# EAGLE design Sat_Cape.v8 (EAGLE 7.5.0)
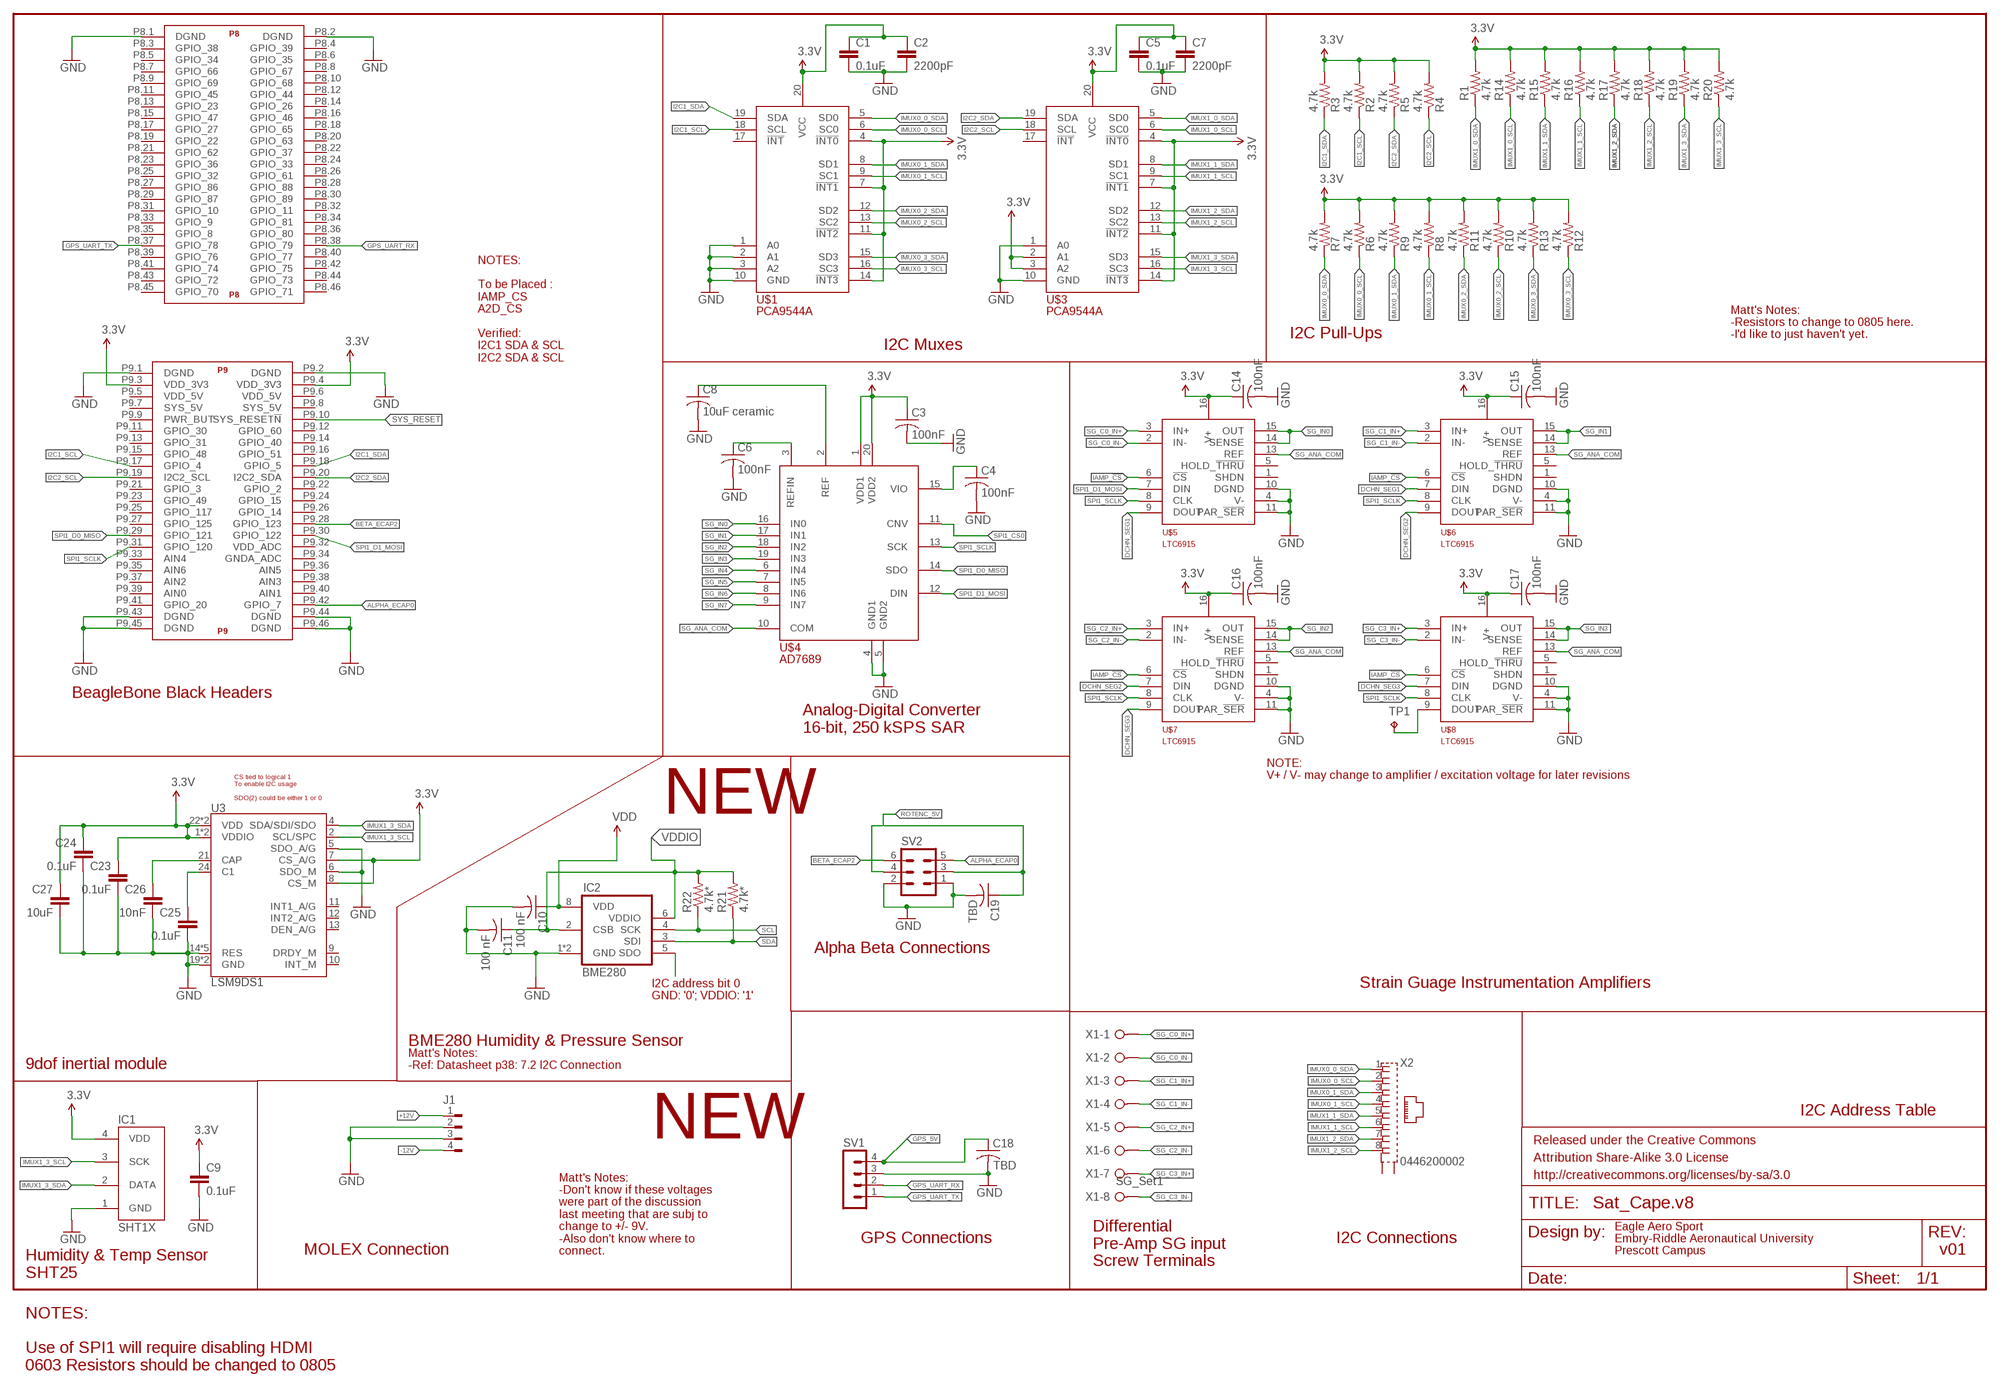
[diagram p0: schematic, sheet 1]

## Parts
C1  0.1uF  0.1UF-25V(+80/-20%)(0603)  [0603-CAP]
C2  2200pF  0.1UF-25V(+80/-20%)(0603)  [0603-CAP]
C3  100nF  C-USC0805  [C0805]
C4  100nF  C-USC0805  [C0805]
C5  0.1uF  0.1UF-25V(+80/-20%)(0603)  [0603-CAP]
C6  100nF  C-USC0805  [C0805]
C7  2200pF  0.1UF-25V(+80/-20%)(0603)  [0603-CAP]
C8  10uF ceramic  C-USC0805  [C0805]
C9  0.1uF  0.1UF-25V(+80/-20%)(0603)  [0603-CAP]
C10  100 nF  C-USC0805  [C0805]
C11  100 nF  C-USC0805  [C0805]
C14  100nF  C-USC0805  [C0805]
C15  100nF  C-USC0805  [C0805]
C16  100nF  C-USC0805  [C0805]
C17  100nF  C-USC0805  [C0805]
C18  TBD  C-USC0805  [C0805]
C19  TBD  C-USC0805  [C0805]
C23  0.1uF  0.1UF-25V(+80/-20%)(0603)  [0603-CAP]
C24  0.1uF  0.1UF-25V(+80/-20%)(0603)  [0603-CAP]
C25  0.1uF  0.1UF-25V(+80/-20%)(0603)  [0603-CAP]
C26  10nF  10NF/10000PF-50V-10%(0603)  [0603-CAP]
C27  10uF  10UF-6.3V-20%(0603)  [0603-CAP]
FRAME1  FRAME-LEDGER  [CREATIVE_COMMONS]
IC1  SHT1X  [SHT1X]
IC2  BME280  [BME280]
J1  FLOPPY-4350211  [350211]
R1  4.7k  R-US_R0805  [R0805]
R2  4.7k  10KOHM1/10W1%(0603)0603  [0603-RES]
R3  4.7k  10KOHM1/10W1%(0603)0603  [0603-RES]
R4  4.7k  10KOHM1/10W1%(0603)0603  [0603-RES]
R5  4.7k  10KOHM1/10W1%(0603)0603  [0603-RES]
R6  4.7k  10KOHM1/10W1%(0603)0603  [0603-RES]
R7  4.7k  10KOHM1/10W1%(0603)0603  [0603-RES]
R8  4.7k  10KOHM1/10W1%(0603)0603  [0603-RES]
R9  4.7k  10KOHM1/10W1%(0603)0603  [0603-RES]
R10  4.7k  10KOHM1/10W1%(0603)0603  [0603-RES]
R11  4.7k  10KOHM1/10W1%(0603)0603  [0603-RES]
R12  4.7k  10KOHM1/10W1%(0603)0603  [0603-RES]
R13  4.7k  10KOHM1/10W1%(0603)0603  [0603-RES]
R14  4.7k  R-US_R0805  [R0805]
R15  4.7k  R-US_R0805  [R0805]
R16  4.7k  R-US_R0805  [R0805]
R17  4.7k  R-US_R0805  [R0805]
R18  4.7k  R-US_R0805  [R0805]
R19  4.7k  R-US_R0805  [R0805]
R20  4.7k  R-US_R0805  [R0805]
R21  4.7k*  R-US_R0805  [R0805]
R22  4.7k*  R-US_R0805  [R0805]
SV1  MA04-1  [MA04-1]
SV2  MA03-2  [MA03-2]
TP1  TPTP08R  [TP08R]
U3  LSM9DS1  [LGA24-8X4]
U$1  PCA9544A  [TSSOP20]
U$2  BEAGLE_BONE_BLACK_CAPE  [BEAGLE_BONE_BLACK_CAPE]
U$3  PCA9544A  [TSSOP20]
U$4  AD7689  [QFN20]
U$5  LTC6915  [SSOP16]
U$6  LTC6915  [SSOP16]
U$7  LTC6915  [SSOP16]
U$8  LTC6915  [SSOP16]
X1  SG_Set1  W237-08P  [W237-8P]
X2  0446200002  [0446200002]

## Nets
3.3V: C1.1 C2.1 C3.1 C5.1 C7.1 C9.1 C14.1 C15.1 C16.1 C17.1 C23.1 C24.1 C27.1 IC1.4(VDD) R1.2 R2.2 R3.2 R4.2 R5.2 R6.2 R7.2 R8.2 R9.2 R10.2 R11.2 R12.2 R13.2 R14.2 R15.2 R16.2 R17.2 R18.2 R19.2 R20.2 U3.1(VDDIO) U3.3(VDDIO) U3.7(CS_A/G) U3.8(CS_M) U3.22(VDD) U3.23(VDD) U$1.4(!INT0!) U$1.7(!INT1!) U$1.11(!INT2!) U$1.14(!INT3!) U$1.20(VCC) U$2.P9.3(P9:VDD_3V3) U$2.P9.4(P9:VDD_3V3) U$3.2(A1) U$3.3(A2) U$3.4(!INT0!) U$3.7(!INT1!) U$3.11(!INT2!) U$3.14(!INT3!) U$3.20(VCC) U$4.1(VDD1) U$4.20(VDD2) U$5.16(V+) U$6.16(V+) U$7.16(V+) U$8.16(V+)
+12V: J1.1
-12V: J1.4
ALPHA_ECAP0: SV2.5 U$2.P9.42(P9:GPIO_7)
BETA_ECAP2: SV2.6 U$2.P9.28(P9:GPIO_123)
C1: C25.1 U3.24(C1)
CAP: C26.1 U3.21(CAP)
DCHN_SEG1: U$5.9(DOUT) U$6.7(DIN)
DCHN_SEG2: U$6.9(DOUT) U$7.7(DIN)
DCHN_SEG3: U$7.9(DOUT) U$8.7(DIN)
GND: C1.2 C2.2 C3.2 C4.2 C5.2 C6.2 C7.2 C8.2 C9.2 C10.2 C11.2 C14.2 C15.2 C16.2 C17.2 C18.2 C19.2 C23.2 C24.2 C25.2 C26.2 C27.2 IC1.1(GND) IC2.1(GND) IC2.7(GND) J1.2 J1.3 SV1.3 SV2.1 SV2.2 U3.5(SDO_A/G) U3.6(SDO_M) U3.14(RES) U3.15(RES) U3.16(RES) U3.17(RES) U3.18(RES) U3.19(GND) U3.20(GND) U$1.1(A0) U$1.2(A1) U$1.3(A2) U$1.10(GND) U$2.P8.1(P8:DGND) U$2.P8.2(P8:DGND) U$2.P9.1(P9:DGND) U$2.P9.2(P9:DGND) U$2.P9.43(P9:DGND) U$2.P9.44(P9:DGND) U$2.P9.45(P9:DGND) U$2.P9.46(P9:DGND) U$3.1(A0) U$3.10(GND) U$4.4(GND1) U$4.5(GND2) U$5.4(V-) U$5.10(DGND) U$5.11(PAR_!SER!) U$6.4(V-) U$6.10(DGND) U$6.11(PAR_!SER!) U$7.4(V-) U$7.10(DGND) U$7.11(PAR_!SER!) U$8.4(V-) U$8.10(DGND) U$8.11(PAR_!SER!)
GPS_5V: C18.1 SV1.4
GPS_UART_RX: SV1.2 U$2.P8.38(P8:GPIO_79)
GPS_UART_TX: SV1.1 U$2.P8.37(P8:GPIO_78)
I2C1_SCL: R2.1 U$1.18(SCL) U$2.P9.17(P9:GPIO_4)
I2C1_SDA: R3.1 U$1.19(SDA) U$2.P9.18(P9:GPIO_5)
I2C2_SCL: R4.1 U$2.P9.19(P9:I2C2_SCL) U$3.18(SCL)
I2C2_SDA: R5.1 U$2.P9.20(P9:I2C2_SDA) U$3.19(SDA)
IAMP_!CS!: U$5.6(!CS!) U$6.6(!CS!) U$7.6(!CS!) U$8.6(!CS!)
IMUX0_0_SCL: R6.1 U$1.6(SC0) X2.2
IMUX0_0_SDA: R7.1 U$1.5(SD0) X2.1
IMUX0_1_SCL: R8.1 U$1.9(SC1) X2.4
IMUX0_1_SDA: R9.1 U$1.8(SD1) X2.3
IMUX0_2_SCL: R10.1 U$1.13(SC2)
IMUX0_2_SDA: R11.1 U$1.12(SD2)
IMUX0_3_SCL: R12.1 U$1.16(SC3)
IMUX0_3_SDA: R13.1 U$1.15(SD3)
IMUX1_0_SCL: R14.1 U$3.6(SC0)
IMUX1_0_SDA: R1.1 U$3.5(SD0)
IMUX1_1_SCL: R16.1 U$3.9(SC1) X2.6
IMUX1_1_SDA: R15.1 U$3.8(SD1) X2.5
IMUX1_2_SCL: R18.1 U$3.13(SC2) X2.8
IMUX1_2_SDA: R17.1 U$3.12(SD2) X2.7
IMUX1_3_SCL: IC1.3(SCK) R20.1 U3.2(SCL/SPC) U$3.16(SC3)
IMUX1_3_SDA: IC1.2(DATA) R19.1 U3.4(SDA/SDI/SDO) U$3.15(SD3)
N$5: C6.1 U$4.3(REFIN)
N$6: C8.1 U$4.2(REF)
N$12: C4.1 U$4.15(VIO)
N$19: TP1.TP U$8.9(DOUT)
N$20: IC2.5(SDO)
ROTENC_5V: C19.1 SV2.3 SV2.4
SCL: IC2.4(SCK) R22.1
SDA: IC2.3(SDI) R21.1
SG_ANA_COM: U$4.10(COM) U$5.13(REF) U$6.13(REF) U$7.13(REF) U$8.13(REF)
SG_C0_IN+: U$5.3(IN+) X1.1
SG_C0_IN-: U$5.2(IN-) X1.2
SG_C1_IN+: U$6.3(IN+) X1.3
SG_C1_IN-: U$6.2(IN-) X1.4
SG_C2_IN+: U$7.3(IN+) X1.5
SG_C2_IN-: U$7.2(IN-) X1.6
SG_C3_IN+: U$8.3(IN+) X1.7
SG_C3_IN-: U$8.2(IN-) X1.8
SG_IN0: U$4.16(IN0) U$5.14(SENSE) U$5.15(OUT)
SG_IN1: U$4.17(IN1) U$6.14(SENSE) U$6.15(OUT)
SG_IN2: U$4.18(IN2) U$7.14(SENSE) U$7.15(OUT)
SG_IN3: U$4.19(IN3) U$8.14(SENSE) U$8.15(OUT)
SG_IN4: U$4.6(IN4)
SG_IN5: U$4.7(IN5)
SG_IN6: U$4.8(IN6)
SG_IN7: U$4.9(IN7)
SPI1_CS0: U$4.11(CNV)
SPI1_D0_MISO: U$2.P9.29(P9:GPIO_121) U$4.14(SDO)
SPI1_D1_MOSI: U$2.P9.30(P9:GPIO_122) U$4.12(DIN) U$5.7(DIN)
SPI1_SCLK: U$2.P9.31(P9:GPIO_120) U$4.13(SCK) U$5.8(CLK) U$6.8(CLK) U$7.8(CLK) U$8.8(CLK)
SYS_RESET: U$2.P9.10(P9:SYS_RESET!N)
VDD: C10.1 IC2.8(VDD)
VDDIO: C11.1 IC2.2(CSB) IC2.6(VDDIO) R21.2 R22.2
Unconnected: U3.9(DRDY_M) U3.10(INT_M) U3.11(INT1_A/G) U3.12(INT2_A/G) U3.13(DEN_A/G) U$1.17(!INT!) U$2.P8.3(P8:GPIO_38) U$2.P8.4(P8:GPIO_39) U$2.P8.5(P8:GPIO_34) U$2.P8.6(P8:GPIO_35) U$2.P8.7(P8:GPIO_66) U$2.P8.8(P8:GPIO_67) U$2.P8.9(P8:GPIO_69) U$2.P8.10(P8:GPIO_68) U$2.P8.11(P8:GPIO_45) U$2.P8.12(P8:GPIO_44) U$2.P8.13(P8:GPIO_23) U$2.P8.14(P8:GPIO_26) U$2.P8.15(P8:GPIO_47) U$2.P8.16(P8:GPIO_46) U$2.P8.17(P8:GPIO_27) U$2.P8.18(P8:GPIO_65) U$2.P8.19(P8:GPIO_22) U$2.P8.20(P8:GPIO_63) U$2.P8.21(P8:GPIO_62) U$2.P8.22(P8:GPIO_37) U$2.P8.23(P8:GPIO_36) U$2.P8.24(P8:GPIO_33) U$2.P8.25(P8:GPIO_32) U$2.P8.26(P8:GPIO_61) U$2.P8.27(P8:GPIO_86) U$2.P8.28(P8:GPIO_88) U$2.P8.29(P8:GPIO_87) U$2.P8.30(P8:GPIO_89) U$2.P8.31(P8:GPIO_10) U$2.P8.32(P8:GPIO_11) U$2.P8.33(P8:GPIO_9) U$2.P8.34(P8:GPIO_81) U$2.P8.35(P8:GPIO_8) U$2.P8.36(P8:GPIO_80) U$2.P8.39(P8:GPIO_76) U$2.P8.40(P8:GPIO_77) U$2.P8.41(P8:GPIO_74) U$2.P8.42(P8:GPIO_75) U$2.P8.43(P8:GPIO_72) U$2.P8.44(P8:GPIO_73) U$2.P8.45(P8:GPIO_70) U$2.P8.46(P8:GPIO_71) U$2.P9.5(P9:VDD_5V) U$2.P9.6(P9:VDD_5V) U$2.P9.7(P9:SYS_5V) U$2.P9.8(P9:SYS_5V) U$2.P9.9(P9:PWR_BUT) U$2.P9.11(P9:GPIO_30) U$2.P9.12(P9:GPIO_60) U$2.P9.13(P9:GPIO_31) U$2.P9.14(P9:GPIO_40) U$2.P9.15(P9:GPIO_48) U$2.P9.16(P9:GPIO_51) U$2.P9.21(P9:GPIO_3) U$2.P9.22(P9:GPIO_2) U$2.P9.23(P9:GPIO_49) U$2.P9.24(P9:GPIO_15) U$2.P9.25(P9:GPIO_117) U$2.P9.26(P9:GPIO_14) U$2.P9.27(P9:GPIO_125) U$2.P9.32(P9:VDD_ADC) U$2.P9.33(P9:AIN4) U$2.P9.34(P9:GNDA_ADC) U$2.P9.35(P9:AIN6) U$2.P9.36(P9:AIN5) U$2.P9.37(P9:AIN2) U$2.P9.38(P9:AIN3) U$2.P9.39(P9:AIN0) U$2.P9.40(P9:AIN1) U$2.P9.41(P9:GPIO_20) U$3.17(!INT!) U$5.1(SHDN) U$5.5(HOLD_!THRU!) U$6.1(SHDN) U$6.5(HOLD_!THRU!) U$7.1(SHDN) U$7.5(HOLD_!THRU!) U$8.1(SHDN) U$8.5(HOLD_!THRU!) X2.S@1(S1) X2.S@2(S2)

## Notes on the sheet
- I2C Pull-Ups
- Matt's Notes: 
  -Resistors to change to 0805 here.
  -I'd like to just haven't yet.
- I2C Muxes
- NOTES:
  
  To be Placed : 
  IAMP_CS
  A2D_CS
  
  Verified:
  I2C1 SDA & SCL
  I2C2 SDA & SCL
- BeagleBone Black Headers
- Analog-Digital Converter
  16-bit, 250 kSPS SAR
- NOTE:
  V+ / V- may change to amplifier / excitation voltage for later revisions
- CS tied to logical 1
  To enable I2C usage
  
  SDO(2) could be either 1 or 0
- NEW
- Alpha Beta Connections
- Strain Guage Instrumentation Amplifiers
- I2C address bit 0
  GND: '0'; VDDIO: '1'
- BME280 Humidity & Pressure Sensor
- 9dof inertial module
- Matt's Notes:
  -Ref: Datasheet p38: 7.2 I2C Connection
- I2C Address Table
- NEW
- GPS Connections | I2C Connections
- MOLEX Connection
- Matt's Notes:
  -Don't know if these voltages 
  were part of the discussion 
  last meeting that are subj to 
  change to +/- 9V.
  -Also don't know where to
  connect.
- Eagle Aero Sport
  Embry-Riddle Aeronautical University
  Prescott Campus
- v01
- Differential
  Pre-Amp SG input
  Screw Terminals
- Humidity & Temp Sensor 
  SHT25
- NOTES:
  
  Use of SPI1 will require disabling HDMI
  0603 Resistors should be changed to 0805

## Library data of the parts
C1 C5 C9 C23-C25 = SparkFun-Capacitors:0.1UF-25V(+80/-20%)(0603): CAP-00810 Ceramic Standard decoupling cap; PROD_ID: CAP-00810
C2 C7 = SparkFun-Capacitors:0.1UF-25V(+80/-20%)(0603): CAP-00810 Ceramic Standard decoupling cap; PROD_ID: CAP-00810; VALUE: 0.1uF
C3 C4 C6 C8 C10 C11 C14-C19 = rcl:C-US: CAPACITOR, American symbol
C26 = SparkFun-Capacitors:10NF/10000PF-50V-10%(0603): CAP-00867; PROD_ID: CAP-00867
C27 = SparkFun-Capacitors:10UF-6.3V-20%(0603): CAP-11015; PROD_ID: CAP-11015
FRAME1 = SparkFun-Aesthetics:FRAME-LEDGER: Schematic Frame Standard 11x14 US Ledger frame
IC1 = sht10_11_15:SHT1X
IC2 = bosch-bme280:BME280: DIGITAL HUMIDITY, PRESSURE AND TEMPERATURE SENSOR * Digital interface I²C (up to 3.4 MHz) and SPI (3 and 4 wire, up to 10 MHz)* Supply voltage VDD main supply voltage range: 1.71 V to 3.6 V*VDDIO interface voltage range: 1.2 V to 3.6 V Operating range -40…+85 °C, 0…100 % rel. humidity, 300…1100 hPa The library has been designed by Richard Magdycz <https://www.facebook.com/groups/eaglecadsoftUK>
J1 = con-amp:FLOPPY-4: MATE N-LOCK Floppy / HDD conector Distributor: Bürklin 71F970
R1 R14-R20 = resistor:R-US_: RESISTOR, American symbol
R2-R13 = SparkFun-Resistors:10KOHM1/10W1%(0603): RES-00824; PROD_ID: RES-00824; VALUE: 10K
R21 R22 = rcl:R-US_: RESISTOR, American symbol
SV1 = con-lstb:MA04-1: PIN HEADER; OC_FARNELL: unknown; OC_NEWARK: unknown
SV2 = con-lstb:MA03-2: PIN HEADER; OC_FARNELL: unknown; OC_NEWARK: unknown
TP1 = testpad:TP: Test pad
U3 = LSM9DS1_temp:LSM9DS1: LSM9DS1 3D accelerometer, gyroscope & magnetometer The LSM9DS1 is a system-in-package featuring a 3D digital linear acceleration sensor, a 3D digital angular rate sensor, and a 3D digital magnetic sensor. The LSM9DS1 has a linear acceleration full scale of ±2g/±4g/±8/±16 g, a magnetic field full scale of ±4/±8/±12/±16 gauss and an angular rate of ±245/±500/±2000 dps. The LSM9DS1 includes an I2 C serial bus interface supporting standard and fast mode (100 kHz and 400 kHz) and an SPI serial standard interface. Magnetic, accelerometer and gyroscope sensing can be enabled or set in power-down mode separately for smart power management. The LSM9DS1 is available in a plastic land grid array package (LGA) and it is guaranteed to operate over an extended temperature range from -40 °C to +85 °C.; PROD_ID: IC-12536
U$1 U$3 = EagleAeroSport:PCA9544A: PCA9544A Low Voltage 4-Channel I2C Mux
U$2 = SparkFun-Boards:BEAGLE_BONE_BLACK_CAPE
U$4 = EagleAeroSport:AD7689: AD7689 Analog Devices 16-bit, 8-channel, 250kSPS PulSAR ADC http://www.analog.com/en/products/analog-to-digital-converters/ad-converters/ad7689.html
U$5-U$8 = EagleAeroSport:LTC6915: LTC6915 Zero Drift, Precision Instrumentation Amplifier with Digitally Programmable Gain http://www.linear.com/product/LTC6915
X1 = con-wago-508:W237-08P: WAGO SREW CLAMP; OC_FARNELL: unknown; OC_NEWARK: unknown
X2 = con-molex:0446200002: RJ-45 INVERTED MODULAR JACK ASSEMBLY WITH RJ-11 KEEPOUT FEATURE Source: Data sheet <http://www.farnell.com/datasheets/73207.pdf> MOLEX 0446200002 BUCHSE, RJ45, GESCHIRMT Source: Farnell <http://de.farnell.com/molex/0446200002/buchse-rj45-geschirmt/dp/9251910?ost=9251910>; MF: MOLEX; MPN: 0446200002; OC_FARNELL: 9251910

## Board
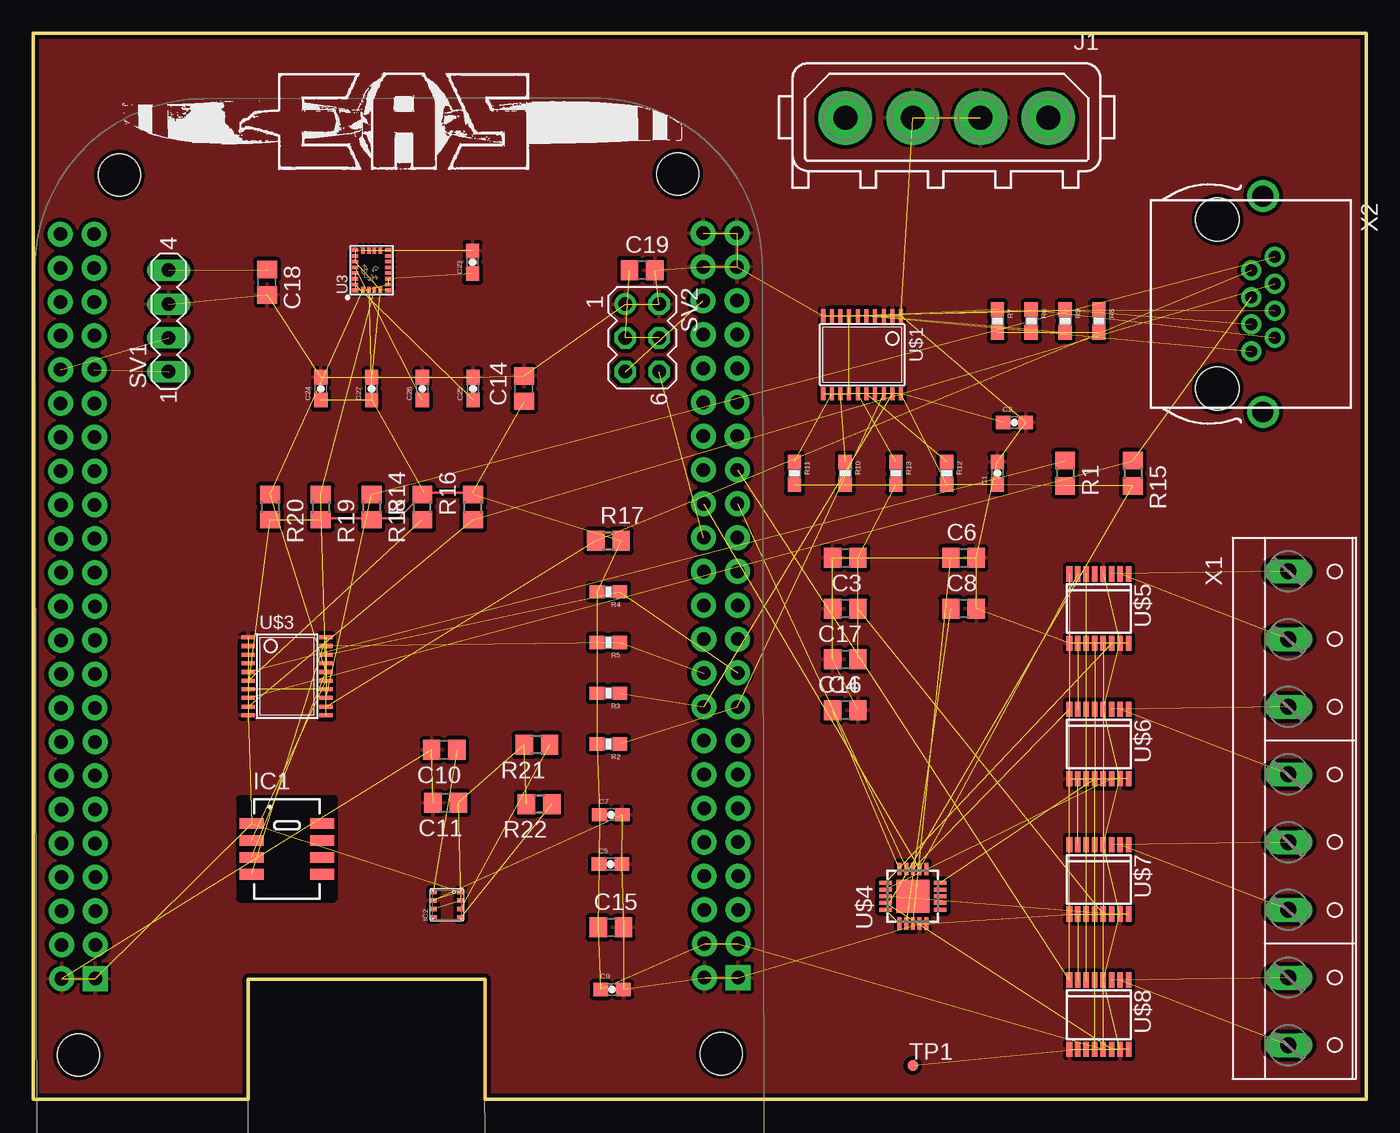
[diagram p1: board, top side]
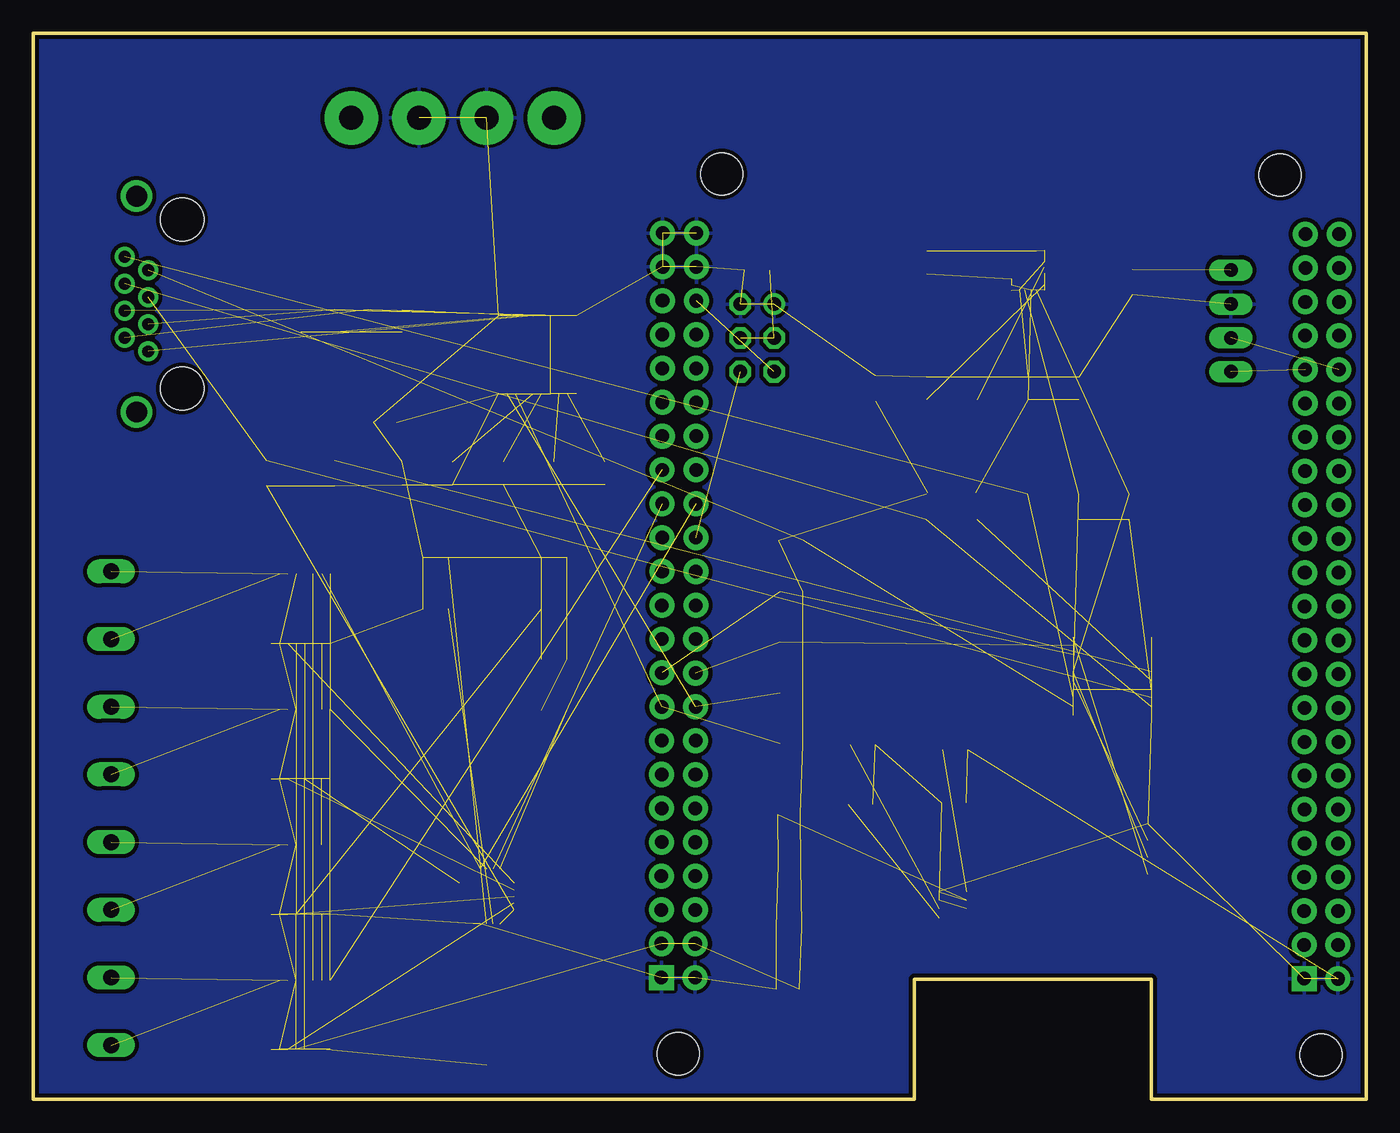
[diagram p2: board, bottom side, seen from below]

Size 100.08 x 80.01 mm. Coordinates in mm from the lower left corner, seen from the top.
Outline: 0,0 16.13,0 16.13,9.02 33.91,9.02 33.91,0 100.08,0 100.08,80.01 0,80.01 0,0
Copper layers (1*16): Top 0.035mm / dielectric 1.5mm / Bottom 0.035mm
Design rules "SparkFun-2-layer": minimum track width 7mil, minimum drill 15mil, track to track 8mil, track to pad 8mil, pad to pad 8mil, via to via 8mil, smd to smd 8mil, copper to edge 8mil, drill to drill 8mil, minimum pad ring 12mil, minimum via ring 10mil, stop-mask expansion 4mil, vias tented up to drill 20mil, thermal gap 10mil

### Footprints (pad centres in the part's own frame; a part is rotated, then mirrored left to right if it is on the bottom)
0603-CAP = smd 1.1 x 1: 1 -0.85,0; 2 0.85,0
C0805 = smd 1.3 x 1.5: 1 -0.95,0; 2 0.95,0
SHT1X = smd 1.803 x 0.8: 1 -2.642,1.905; 2 -2.642,0.635; 3 -2.642,-0.635; 4 -2.642,-1.905; 5 2.642,-1.905; 6 2.642,-0.635; 7 2.642,0.635; 8 2.642,1.905
BME280 = smd 0.35 x 0.5: 1 0.975,-1.025; 2 0.325,-1.025; 3 -0.325,-1.025; 4 -0.975,-1.025; 5 -0.975,1.025; 6 -0.325,1.025; 7 0.325,1.025; 8 0.975,1.025
350211 = drill 1.8 pad 4: 1 -7.62,0; 2 -2.54,0; 3 2.54,0; 4 7.62,0
R0805 = smd 1.3 x 1.5: 1 -0.95,0; 2 0.95,0
0603-RES = smd 1.1 x 1: 1 -0.85,0; 2 0.85,0
MA04-1 = drill 1.016 long: 1 -3.81,0; 2 -1.27,0; 3 1.27,0; 4 3.81,0
MA03-2 = drill 1.016: 1 -2.54,-1.27 | drill 1.016 octagon: 2 -2.54,1.27; 3 0,-1.27; 4 0,1.27; 5 2.54,-1.27; 6 2.54,1.27
TP08R = smd 0.8 x 0.8: TP 0,0
LGA24-8X4 = smd 0.27 x 0.45: 1 -1.505,1.225; 6 -1.505,-1.225; 7 -1.075,-1.225; 8 -0.645,-1.225; 9 -0.215,-1.225; 10 0.215,-1.225; 11 0.645,-1.225; 12 1.075,-1.225; 13 1.505,-1.225; 18 1.505,1.225; 19 1.075,1.225; 20 0.645,1.225; 21 0.215,1.225; 22 -0.215,1.225; 23 -0.645,1.225; 24 -1.075,1.225 | smd 0.45 x 0.27: 2 -1.475,0.645; 3 -1.475,0.215; 4 -1.475,-0.215; 5 -1.475,-0.645; 14 1.475,-0.645; 15 1.475,-0.215; 16 1.475,0.215; 17 1.475,0.645
TSSOP20 = smd 0.305 x 0.991: 1 -2.925,-2.918; 2 -2.275,-2.918; 3 -1.625,-2.918; 4 -0.975,-2.918; 5 -0.325,-2.918; 6 0.325,-2.918; 7 0.975,-2.918; 8 1.625,-2.918; 9 2.275,-2.918; 10 2.925,-2.918; 11 2.925,2.918; 12 2.275,2.918; 13 1.625,2.918; 14 0.975,2.918; 15 0.325,2.918; 16 -0.325,2.918; 17 -0.975,2.918; 18 -1.625,2.918; 19 -2.275,2.918; 20 -2.925,2.918
BEAGLE_BONE_BLACK_CAPE = drill 1.016 pad 1.88 square: P8.1 20.32,50.165; P9.1 20.32,1.905 | drill 1.016 pad 1.88: P8.2 20.32,52.705; P8.3 22.86,50.165; P8.4 22.86,52.705; P8.5 25.4,50.165; P8.6 25.4,52.705; P8.7 27.94,50.165; P8.8 27.94,52.705; P8.9 30.48,50.165; P8.10 30.48,52.705; P8.11 33.02,50.165; P8.12 33.02,52.705; P8.13 35.56,50.165; P8.14 35.56,52.705; P8.15 38.1,50.165; P8.16 38.1,52.705; P8.17 40.64,50.165; P8.18 40.64,52.705; P8.19 43.18,50.165; P8.20 43.18,52.705; P8.21 45.72,50.165; P8.22 45.72,52.705; P8.23 48.26,50.165; P8.24 48.26,52.705; P8.25 50.8,50.165; P8.26 50.8,52.705; P8.27 53.34,50.165; P8.28 53.34,52.705; P8.29 55.88,50.165; P8.30 55.88,52.705; P8.31 58.42,50.165; P8.32 58.42,52.705; P8.33 60.96,50.165; P8.34 60.96,52.705; P8.35 63.5,50.165; P8.36 63.5,52.705; P8.37 66.04,50.165; P8.38 66.04,52.705; P8.39 68.58,50.165; P8.40 68.58,52.705; P8.41 71.12,50.165; P8.42 71.12,52.705; P8.43 73.66,50.165; P8.44 73.66,52.705; P8.45 76.2,50.165; P8.46 76.2,52.705; P9.2 20.32,4.445; P9.3 22.86,1.905; P9.4 22.86,4.445; P9.5 25.4,1.905; P9.6 25.4,4.445; P9.7 27.94,1.905; P9.8 27.94,4.445; P9.9 30.48,1.905; P9.10 30.48,4.445; P9.11 33.02,1.905; P9.12 33.02,4.445; P9.13 35.56,1.905; P9.14 35.56,4.445; P9.15 38.1,1.905; P9.16 38.1,4.445; P9.17 40.64,1.905; P9.18 40.64,4.445; P9.19 43.18,1.905; P9.20 43.18,4.445; P9.21 45.72,1.905; P9.22 45.72,4.445; P9.23 48.26,1.905; P9.24 48.26,4.445; P9.25 50.8,1.905; P9.26 50.8,4.445; P9.27 53.34,1.905; P9.28 53.34,4.445; P9.29 55.88,1.905; P9.30 55.88,4.445; P9.31 58.42,1.905; P9.32 58.42,4.445; P9.33 60.96,1.905; P9.34 60.96,4.445; P9.35 63.5,1.905; P9.36 63.5,4.445; P9.37 66.04,1.905; P9.38 66.04,4.445; P9.39 68.58,1.905; P9.40 68.58,4.445; P9.41 71.12,1.905; P9.42 71.12,4.445; P9.43 73.66,1.905; P9.44 73.66,4.445; P9.45 76.2,1.905; P9.46 76.2,4.445 | hole 3.175: 14.605,3.175; 80.645,6.35; 80.645,48.26; 14.605,51.435
QFN20 = smd 0.95 x 0.3: 1 -2.05,1; 2 -2.05,0.5; 3 -2.05,0; 4 -2.05,-0.5; 5 -2.05,-1; 11 2.05,-1; 12 2.05,-0.5; 13 2.05,0; 14 2.05,0.5; 15 2.05,1 | smd 0.3 x 0.95: 6 -1,-2.05; 7 -0.5,-2.05; 8 0,-2.05; 9 0.5,-2.05; 10 1,-2.05; 16 1,2.05; 17 0.5,2.05; 18 0,2.05; 19 -0.5,2.05; 20 -1,2.05 | smd 2.45 x 2.45: EXP 0,0
SSOP16 = smd 0.419 x 1.143: 1 -2.223,-2.6; 2 -1.587,-2.6; 3 -0.953,-2.6; 4 -0.318,-2.6; 5 0.318,-2.6; 6 0.953,-2.6; 7 1.587,-2.6; 8 2.223,-2.6; 9 1.587,2.6; 10 -1.587,2.6; 11 2.223,2.6; 12 0.953,2.6; 13 0.318,2.6; 14 -2.223,2.6; 15 -0.953,2.6; 16 -0.318,2.6
W237-8P = drill 1.194 long: 1 -17.78,-0.635; 2 -12.7,-0.635; 3 -7.62,-0.635; 4 -2.54,-0.635; 5 2.54,-0.635; 6 7.62,-0.635; 7 12.7,-0.635; 8 17.78,-0.635
0446200002 = drill 0.889 pad 1.422: 1 3.556,2.54; 2 2.54,4.318; 3 1.524,2.54; 4 0.508,4.318; 5 -0.508,2.54; 6 -1.524,4.318; 7 -2.54,2.54; 8 -3.556,4.318 | drill 1.575 pad 2.286: S@1 -8.103,3.429; S@2 8.103,3.429 | hole 3.251: 6.35,0; -6.35,0

### Placement (x,y rotation side)
C1  72.39,46.99 90 top
C2  73.66,50.8 0 top
C3  60.96,40.64 180 top
C4  60.96,29.21 0 top
C5  43.33,17.65 0 top
C6  69.85,40.64 0 top
C7  43.36,21.36 0 top
C8  69.85,36.83 0 top
C9  43.45,8.25 0 top
C10  30.85,26.24 180 top
C11  30.95,22.26 180 top
C14  36.83,53.34 90 top
C15  43.36,12.9 0 top
C16  60.96,33.02 180 top
C17  60.96,36.83 180 top
C18  17.55,61.33 270 top
C19  45.72,62.23 0 top
C23  32.99,62.83 90 top
C24  21.59,53.34 90 top
C25  33.02,53.34 90 top
C26  29.21,53.34 90 top
C27  25.4,53.34 90 top
FRAME1  108.97,21.46 90 top  (outside the outline)
IC1  19.05,18.8 0 top
IC2  31.06,14.61 90 top
J1  68.58,73.66 180 top
R1  77.47,46.99 270 top
R2  43.18,26.67 180 top
R3  43.18,30.48 180 top
R4  43.18,38.1 180 top
R5  43.18,34.29 180 top
R6  74.93,58.42 270 top
R7  72.39,58.42 270 top
R8  80.01,58.42 270 top
R9  77.47,58.42 270 top
R10  60.96,46.99 270 top
R11  57.15,46.99 270 top
R12  68.58,46.99 270 top
R13  64.77,46.99 270 top
R14  29.21,44.45 90 top
R15  82.55,46.99 270 top
R16  33.02,44.45 90 top
R17  43.18,41.91 0 top
R18  25.4,44.45 270 top
R19  21.59,44.45 270 top
R20  17.78,44.45 270 top
R21  37.81,26.6 180 top
R22  37.97,22.16 180 top
SV1  10.16,58.42 90 top
SV2  45.72,57.15 270 top
TP1  66.04,2.54 0 top
U3  25.4,62.23 90 top
U$1  62.23,55.88 180 top
U$2  54.86,-11.18 90.1 top
U$3  19.05,31.75 270 top
U$4  66.04,15.24 90 top
U$5  80.01,36.83 180 top
U$6  80.01,26.67 180 top
U$7  80.01,16.51 180 top
U$8  80.01,6.35 180 top
X1  94.87,21.84 270 top
X2  88.9,59.69 270 top

### Tracks (layer width: path | path; a pad name or v marks a point on that pad's centre or on a via)
3.3V  (56 unrouted)
  Top 0.178: R19.2 21.72,43.62 25.34,43.62 R18.2 25.53,43.62 27.43,43.62 29.15,45.34 R14.2 29.34,45.53 32.96,45.53 R16.2
ALPHA_ECAP0  (1 unrouted)
BETA_ECAP2  (1 unrouted)
C1  (1 unrouted)
CAP  (1 unrouted)
DCHN_SEG1  (1 unrouted)
DCHN_SEG2  (1 unrouted)
DCHN_SEG3  (1 unrouted)
GND  (66 unrouted)
  pour Top (isolate 0.305, rank 6): 0,80.01 100.08,80.01 100.08,0 0,0
  pour Bottom (isolate 0.305): 0,80.01 100.08,80.01 100.08,0 0,0
GPS_5V  (1 unrouted)
GPS_UART_RX  (1 unrouted)
GPS_UART_TX  (1 unrouted)
I2C1_SCL  (2 unrouted)
I2C1_SDA  (2 unrouted)
I2C2_SCL  (2 unrouted)
I2C2_SDA  (2 unrouted)
IAMP_!CS!  (3 unrouted)
IMUX0_0_SCL  (2 unrouted)
IMUX0_0_SDA  (2 unrouted)
IMUX0_1_SCL  (2 unrouted)
IMUX0_1_SDA  (2 unrouted)
IMUX0_2_SCL  (1 unrouted)
IMUX0_2_SDA  (1 unrouted)
IMUX0_3_SCL  (1 unrouted)
IMUX0_3_SDA  (1 unrouted)
IMUX1_0_SCL  (1 unrouted)
IMUX1_0_SDA  (1 unrouted)
IMUX1_1_SCL  (2 unrouted)
IMUX1_1_SDA  (2 unrouted)
IMUX1_2_SCL  (2 unrouted)
IMUX1_2_SDA  (2 unrouted)
IMUX1_3_SCL  (3 unrouted)
IMUX1_3_SDA  (3 unrouted)
N$5  (1 unrouted)
N$6  (1 unrouted)
N$12  (1 unrouted)
N$19  (1 unrouted)
ROTENC_5V  (2 unrouted)
SCL  (1 unrouted)
SDA  (1 unrouted)
SG_ANA_COM  (4 unrouted)
SG_C0_IN+  (1 unrouted)
SG_C0_IN-  (1 unrouted)
SG_C1_IN+  (1 unrouted)
SG_C1_IN-  (1 unrouted)
SG_C2_IN+  (1 unrouted)
SG_C2_IN-  (1 unrouted)
SG_C3_IN+  (1 unrouted)
SG_C3_IN-  (1 unrouted)
SG_IN0  (2 unrouted)
SG_IN1  (2 unrouted)
SG_IN2  (2 unrouted)
SG_IN3  (2 unrouted)
SPI1_D0_MISO  (1 unrouted)
SPI1_D1_MOSI  (2 unrouted)
SPI1_SCLK  (5 unrouted)
VDD  (1 unrouted)
VDDIO  (4 unrouted)

### Text on the board
tPlace: C:/Users/Mashlee/Desktop/EAGLE AERO SPORT/eas try 2/17.6.bmp
tDocu: Eagle Aero Sport | Matt's Notes: / -Played with autorouter to get an idea of a "grouping" / of components until we have a more solid idea. / -Resistors still need to change to 0805 and then be / re-"placed" on brd. / -Components need to be re-aligned to larger grid. / -Will clean up the EAS Logo silkscreen, let me know if / you think it's tackey. / -Also up for ideas on how to make connectors most / easily accessible.